# Altium schematic sheet Papilio_DUO_2.SchDoc: Papilio_DUO
size 270 x 207 mm; Date: 05/10/2018 09:53:56 p.m.; Organization: INVAP S.E.; Address1: Argentina; Address2: Rio Negro; Address3: Bariloche; Address4: Cte. Luis Piedra Buena 4950; SheetNumber: 3; DATABASE: C:/Dropbox/GadgetFactory/GadgetFactory_Engineering/Libraries/GadgetFactory-PARTSDB.txt; Rule: PcbType=ProtelPcb
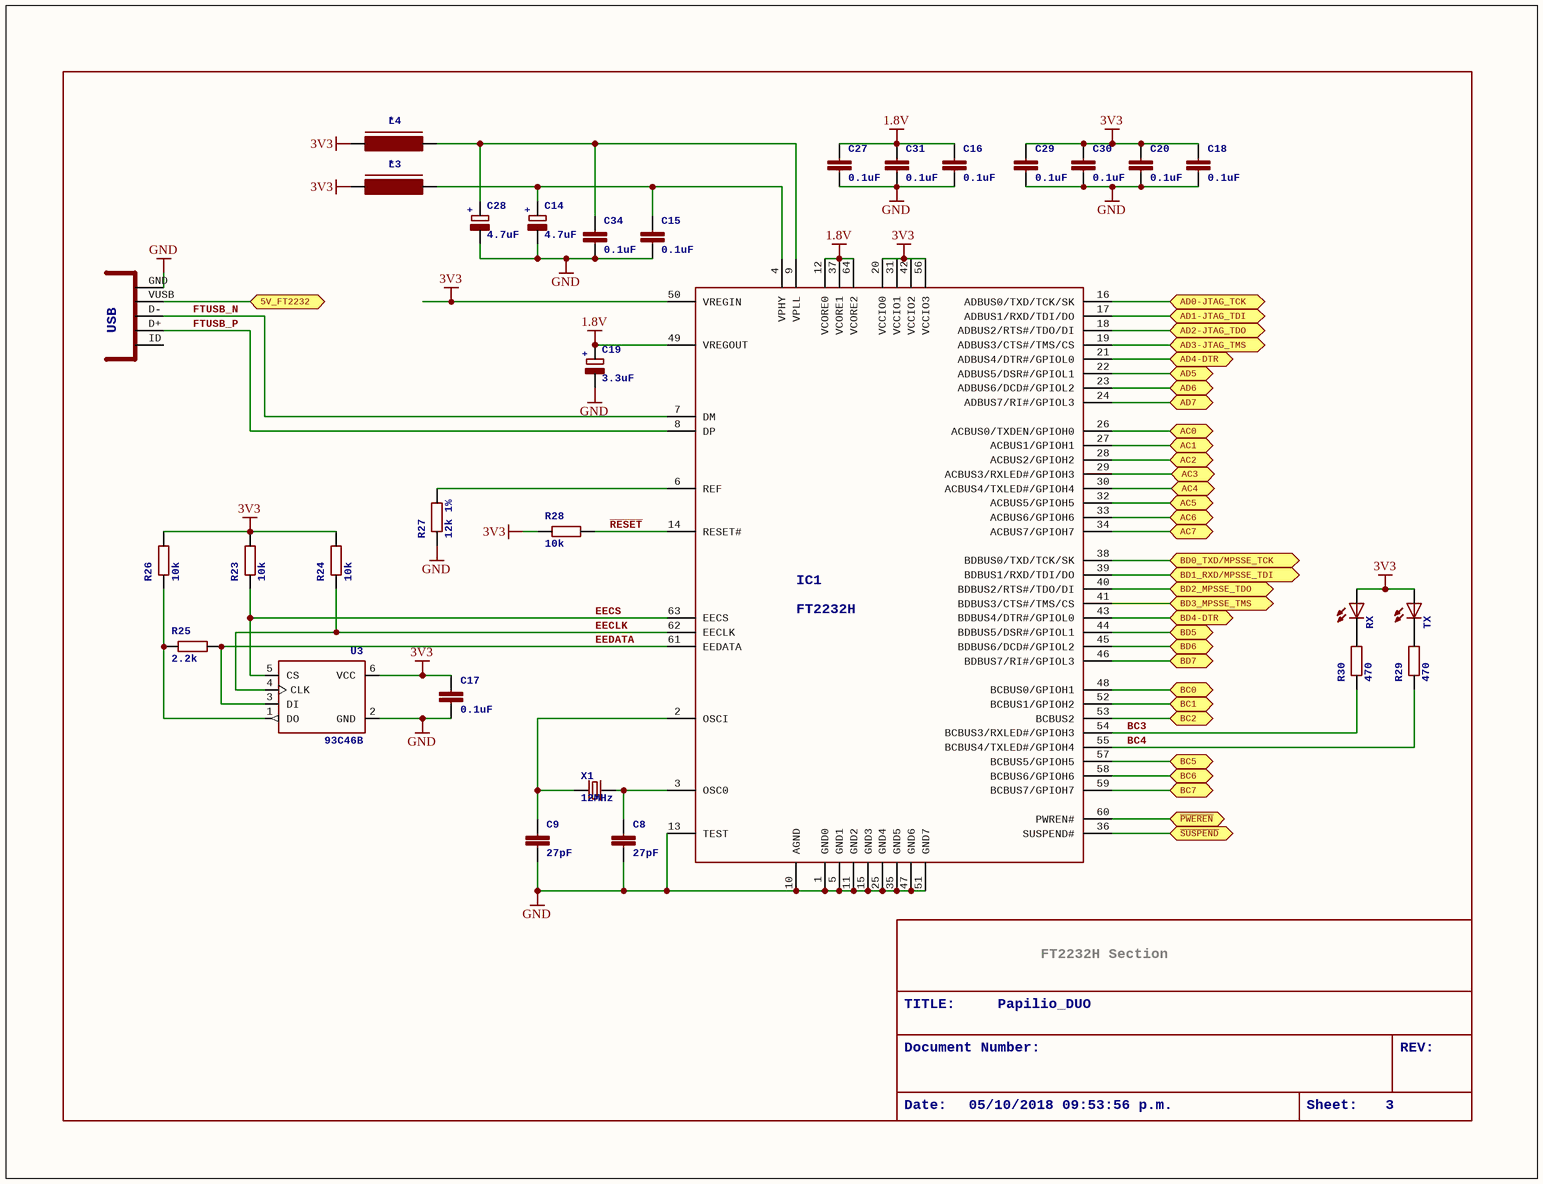
[diagram p0: Papilio_DUO_2.SchDoc]

## Parts
C8  27pF  [C603]
C9  27pF  [C603]
C14  4.7uF  [SMC_A]
C15  0.1uF  [C603]
C16  0.1uF  [C603]
C17  0.1uF  [C603]
C18  0.1uF  [C603]
C19  3.3uF  [SMC_A]
C20  0.1uF  [C603]
C27  0.1uF  [C603]
C28  4.7uF  [SMC_A]
C29  0.1uF  [C603]
C30  0.1uF  [C603]
C31  0.1uF  [C603]
C34  0.1uF  [C603]
FPGAUSB  CONN_USB  [CONN_USB_MINI-B]  (value not drawn)
IC1  FT2232H  [LQFP64]
L3  FERRITE_BEAD603  [FB603]  (value not drawn)
L4  FERRITE_BEAD603  [FB603]  (value not drawn)
R23  10k  [R603]
R24  10k  [R603]
R25  2.2k  [R603]
R26  10k  [R603]
R27  12k 1%  [R603]
R28  10k  [R603]
R29  470  [R603]
R30  470  [R603]
RX  LED805  [LED-805]  (value not drawn)
TX  LED805  [LED-805]  (value not drawn)
U3  93C46B  [SOT23-6]
X1  12MHz  [4X6]

## Ports
5V_FT2232, AC0, AC1, AC2, AC3, AC4, AC5, AC6, AC7, AD0-JTAG_TCK, AD1-JTAG_TDI, AD2-JTAG_TDO, AD3-JTAG_TMS, AD4-DTR, AD5, AD6, AD7, BC0, BC1, BC2, BC5, BC6, BC7, BD0_TXD/MPSSE_TCK, BD1_RXD/MPSSE_TDI, BD2_MPSSE_TDO, BD3_MPSSE_TMS, BD4-DTR, BD5, BD6, BD7, ~{PWEREN}, ~{SUSPEND}

## Nets
1.8V: C16.1 C19.+ C27.1 C31.1 IC1.12(VCORE0) IC1.37(VCORE1) IC1.49(VREGOUT) IC1.64(VCORE2)
3V3: C17.1 C18.1 C20.1 C29.1 C30.1 IC1.20(VCCIO0) IC1.31(VCCIO1) IC1.42(VCCIO2) IC1.50(VREGIN) IC1.56(VCCIO3) L3.2 L4.2 R23.2 R24.2 R26.2 R28.1 RX.A TX.A U3.6(VCC)
GND: C8.2 C9.2 C14.- C15.2 C16.2 C17.2 C18.2 C19.- C20.2 C27.2 C28.- C29.2 C30.2 C31.2 C34.2 FPGAUSB.GND IC1.1(GND0) IC1.5(GND1) IC1.10(AGND) IC1.11(GND2) IC1.13(TEST) IC1.15(GND3) IC1.25(GND4) IC1.35(GND5) IC1.47(GND6) IC1.51(GND7) R27.1 U3.2(GND)
5V_FT2232: FPGAUSB.VUSB ; port 5V_FT2232
AC0: IC1.26(ACBUS0/TXDEN/GPIOH0) ; port AC0
AC1: IC1.27(ACBUS1/GPIOH1) ; port AC1
AC2: IC1.28(ACBUS2/GPIOH2) ; port AC2
AC3: IC1.29(ACBUS3/RXLED#/GPIOH3) ; port AC3
AC4: IC1.30(ACBUS4/TXLED#/GPIOH4) ; port AC4
AC5: IC1.32(ACBUS5/GPIOH5) ; port AC5
AC6: IC1.33(ACBUS6/GPIOH6) ; port AC6
AC7: IC1.34(ACBUS7/GPIOH7) ; port AC7
AD0-JTAG_TCK: IC1.16(ADBUS0/TXD/TCK/SK) ; port AD0-JTAG_TCK
AD1-JTAG_TDI: IC1.17(ADBUS1/RXD/TDI/DO) ; port AD1-JTAG_TDI
AD2-JTAG_TDO: IC1.18(ADBUS2/RTS#/TDO/DI) ; port AD2-JTAG_TDO
AD3-JTAG_TMS: IC1.19(ADBUS3/CTS#/TMS/CS) ; port AD3-JTAG_TMS
AD4-DTR: IC1.21(ADBUS4/DTR#/GPIOL0) ; port AD4-DTR
AD5: IC1.22(ADBUS5/DSR#/GPIOL1) ; port AD5
AD6: IC1.23(ADBUS6/DCD#/GPIOL2) ; port AD6
AD7: IC1.24(ADBUS7/RI#/GPIOL3) ; port AD7
BC0: IC1.48(BCBUS0/GPIOH1) ; port BC0
BC1: IC1.52(BCBUS1/GPIOH2) ; port BC1
BC2: IC1.53(BCBUS2) ; port BC2
BC3: IC1.54(BCBUS3/RXLED#/GPIOH3) R30.1
BC4: IC1.55(BCBUS4/TXLED#/GPIOH4) R29.1
BC5: IC1.57(BCBUS5/GPIOH5) ; port BC5
BC6: IC1.58(BCBUS6/GPIOH6) ; port BC6
BC7: IC1.59(BCBUS7/GPIOH7) ; port BC7
BD0_TXD/MPSSE_TCK: IC1.38(BDBUS0/TXD/TCK/SK) ; port BD0_TXD/MPSSE_TCK
BD1_RXD/MPSSE_TDI: IC1.39(BDBUS1/RXD/TDI/DO) ; port BD1_RXD/MPSSE_TDI
BD2_MPSSE_TDO: IC1.40(BDBUS2/RTS#/TDO/DI) ; port BD2_MPSSE_TDO
BD3_MPSSE_TMS: IC1.41(BDBUS3/CTS#/TMS/CS) ; port BD3_MPSSE_TMS
BD4-DTR: IC1.43(BDBUS4/DTR#/GPIOL0) ; port BD4-DTR
BD5: IC1.44(BDBUS5/DSR#/GPIOL1) ; port BD5
BD6: IC1.45(BDBUS6/DCD#/GPIOL2) ; port BD6
BD7: IC1.46(BDBUS7/RI#/GPIOL3) ; port BD7
EECLK: IC1.62(EECLK) R24.1 U3.4(CLK)
EECS: IC1.63(EECS) R23.1 U3.5(CS)
EEDATA: IC1.61(EEDATA) R25.2 U3.3(DI)
FTUSB_N: FPGAUSB.D- IC1.7(DM)
FTUSB_P: FPGAUSB.D+ IC1.8(DP)
~{PWEREN}: IC1.60(PWREN#) ; port ~{PWEREN}
~{RESET}: IC1.14(RESET#) R28.2
~{SUSPEND}: IC1.36(SUSPEND#) ; port ~{SUSPEND}
NetC8_1: C8.1 IC1.3(OSC0) X1.2(X2)
NetC9_1: C9.1 IC1.2(OSCI) X1.1(X1)
NetC14_+: C14.+ C15.1 IC1.4(VPHY) L3.1
NetC28_+: C28.+ C34.1 IC1.9(VPLL) L4.1
NetIC1_6: IC1.6(REF) R27.2
NetR25_1: R25.1 R26.1 U3.1(DO)
NetR29_2: R29.2 TX.C
NetR30_2: R30.2 RX.C

Not connected (* = marked no-connect by the designer): FPGAUSB ID(USBID)

## Notes on the sheet
- FT2232H Section
- TITLE:
- Document Number:
- Papilio_DUO
- REV:
- Date:
- 05/10/2018 09:53:56 p.m.
- Sheet:
- 3
- Título:
- Nº
- Hoja:
- de:
- Escala:
- *

## Library data of the parts
C8 C9 C15-C18 C20 C27 C29-C31 C34 = CAPC603: PARTNO: *
C14 C19 C28 = CAP_POLSMC_A: PARTNO: *; +: +
FPGAUSB = CONN_USB: USB connector; PARTNO: *; USB: USB
IC1 = FT2232H: DUAL HIGH SPEED USB TO MULTIPURPOSE UART/FIFO IC; PARTNO: *
R23-R30 = RESISTORR603: PARTNO: *
U3 = DIGITAL-EEPROM-MICROWIRE-6P_SOT23: PARTNO: *
X1 = CRYSTAL_212M_: PARTNO: *
L3 L4 = FERRITE_BEAD603: NAME: *; PARTNO: *
RX TX = LED805: PARTNO: *